# EAGLE design PCB-MicroSmartE (EAGLE 7.5.0)
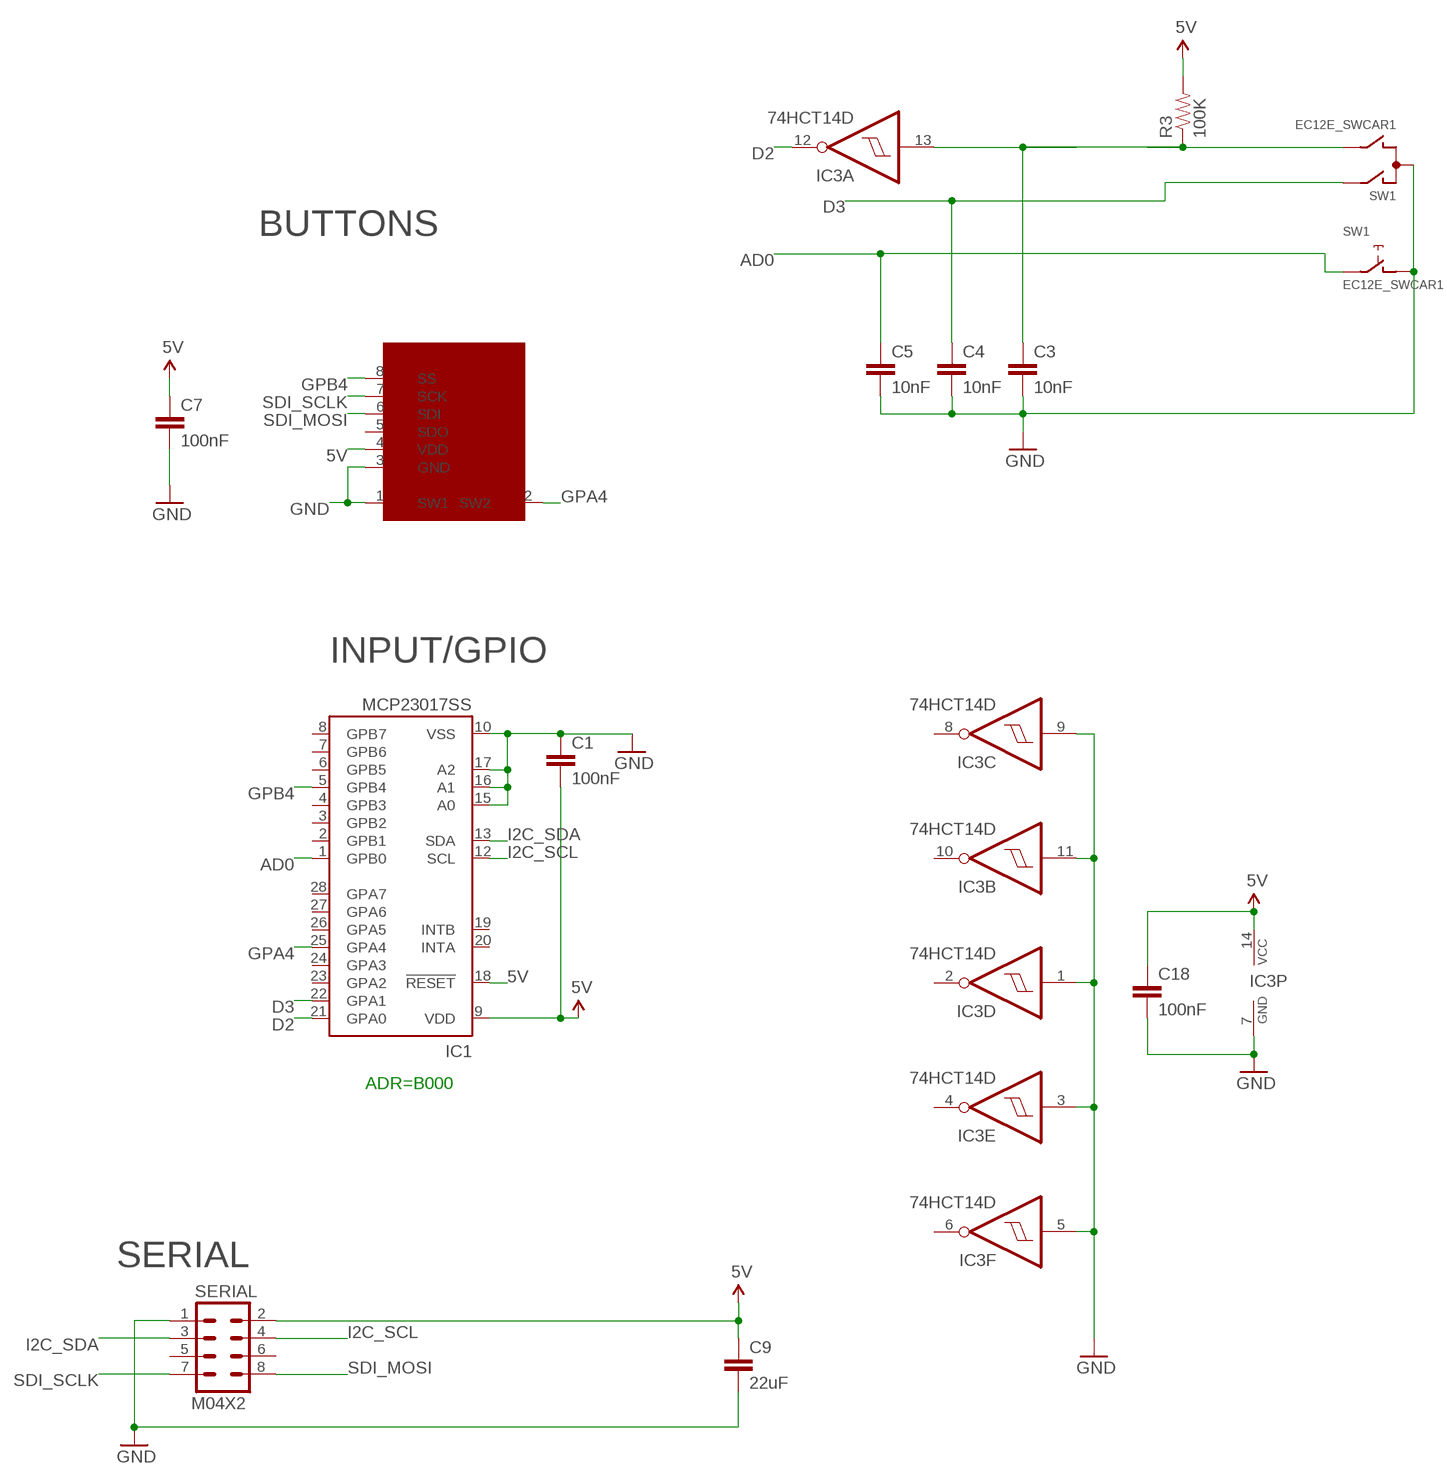
[diagram p0: schematic, sheet 1]

## Parts
C1  100nF  CAP0603-CAP  [0603-CAP]
C3  10nF  CAP0603-CAP  [0603-CAP]
C4  10nF  CAP0603-CAP  [0603-CAP]
C5  10nF  CAP0603-CAP  [0603-CAP]
C7  100nF  CAP0603-CAP  [0603-CAP]
C9  22uF  CAP0805  [0805]
C18  100nF  CAP0603-CAP  [0603-CAP]
IC1  MCP23017SS  [SSOP28]
IC3  74HCT14D  [SO14]
R3  100K  RESISTOR0603-RES  [0603-RES]
SERIAL  M04X2  [2X4]
SSW1  SMART_SWITCHSMART_SWITCH_8PIN  [SMART_SWITCH]
SW1  EC12E_SWCAR1  [ALPS_EC12E_SW-CAR1]

## Nets
5V [Power]: C1.2 C7.1 C9.1 C18.1 IC1.9(VDD) IC1.18(!RESET) IC3.14(P:VCC) R3.2 SERIAL.2 SSW1.4(VDD)
AD0: C5.1 IC1.1(GPB0) SW1.E
D2: IC1.21(GPA0) IC3.12(A:O)
D3: C4.1 IC1.22(GPA1) SW1.A
GND [Power]: C1.1 C3.2 C4.2 C5.2 C7.2 C9.2 C18.2 IC1.10(VSS) IC1.15(A0) IC1.16(A1) IC1.17(A2) IC3.1(D:I) IC3.3(E:I) IC3.5(F:I) IC3.7(P:GND) IC3.9(C:I) IC3.11(B:I) SERIAL.1 SSW1.1(SW1) SSW1.3(GND) SW1.C SW1.D
GPA4: IC1.25(GPA4) SSW1.2(SW2)
GPB4: IC1.5(GPB4) SSW1.8(SS)
I2C_SCL: IC1.12(SCL) SERIAL.4
I2C_SDA: IC1.13(SDA) SERIAL.3
N$1: C3.1 IC3.13(A:I) R3.1 SW1.B
SDI_MOSI: SERIAL.8 SSW1.6(SDI)
SDI_SCLK: SERIAL.7 SSW1.7(SCK)
Unconnected: IC1.2(GPB1) IC1.3(GPB2) IC1.4(GPB3) IC1.6(GPB5) IC1.7(GPB6) IC1.8(GPB7) IC1.19(INTB) IC1.20(INTA) IC1.23(GPA2) IC1.24(GPA3) IC1.26(GPA5) IC1.27(GPA6) IC1.28(GPA7) IC3.2(D:O) IC3.4(E:O) IC3.6(F:O) IC3.8(C:O) IC3.10(B:O) SERIAL.5 SERIAL.6 SSW1.5(SDO) SW1.GND1(G) SW1.GND2(G)

## Notes on the sheet
- BUTTONS
- INPUT/GPIO
- ADR=B000
- SERIAL

## Library data of the parts
C1 C3-C5 C7 C9 C18 = SparkFun:CAP: Capacitor Standard 0603 ceramic capacitor, and 0.1" leaded capacitor.
IC1 = microchip:MCP23017: http://ww1.microchip.com/downloads/en/DeviceDoc/21952a.pdf Source: http://ww1.microchip.com/downloads/en/DeviceDoc/21952a.pdf; MF: MICROCHIP; MPN: MCP23017-E/SS; OC_FARNELL: 1467674; OC_NEWARK: 31K2960
IC3 = 74xx-eu:74*14: Hex schmitt trigger INVERTER
R3 = SparkFun:RESISTOR: Resistor Basic schematic elements and footprints for 0603, 1206, and PTH resistors.
SERIAL = SparkFun:M04X2
SSW1 = SKAARHOJ:SMART_SWITCH: SMARTSWITCH IS15DSBFP4RGB www.nkksmartswitch.com
SW1 = SKAARHOJ:EC12E_SW: ALPS rotary Encoder EC12E series with switch

## Net classes
0 default: width 0.203 mm, drill 0.406 mm, clearance 0.203 mm
1 Power: width 0.406 mm, drill 0.61 mm, clearance 0.203 mm

## Board
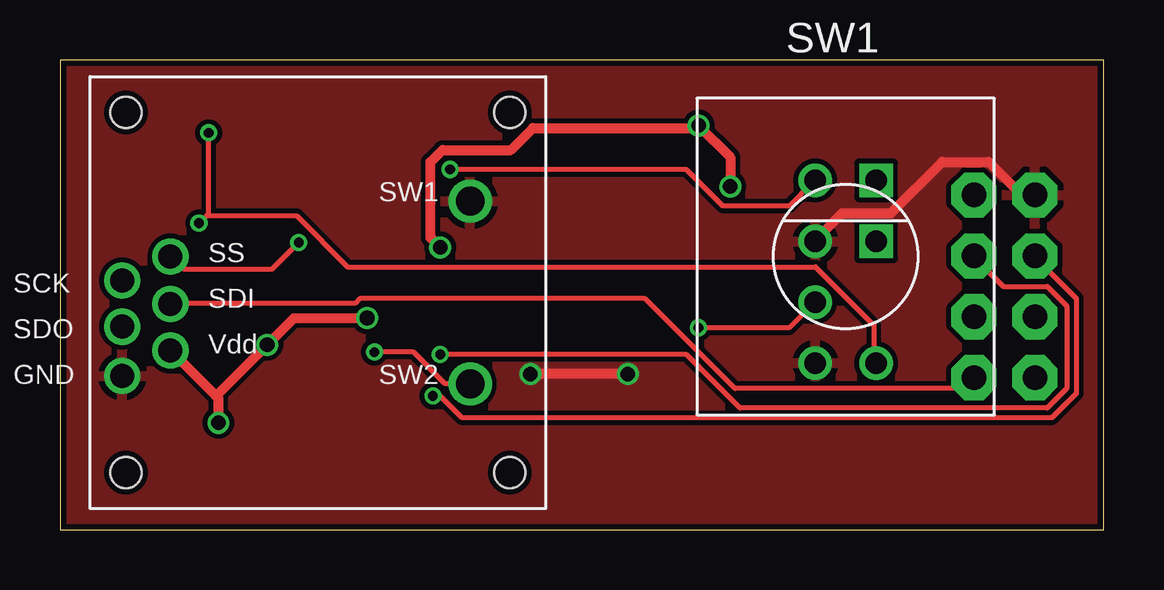
[diagram p1: board, top side]
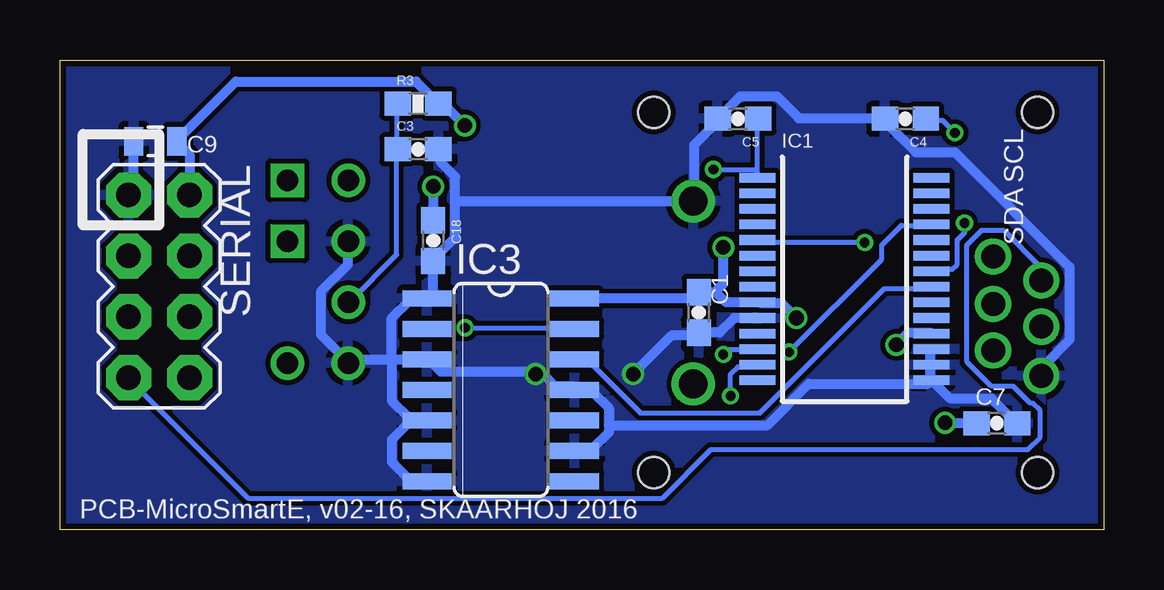
[diagram p2: board, bottom side, seen from below]

Size 43.5 x 19.6 mm. Coordinates in mm from the lower left corner, seen from the top.
Outline: 0,0 43.5,0 43.5,19.6 0,19.6 0,0
Copper layers (1*16): Top 0.035mm / dielectric 1.5mm / Bottom 0.035mm
Design rules "Fusion_eagle_rule_v1.1": minimum track width 6mil, minimum drill 12mil, track to track 6mil, track to pad 6mil, pad to pad 6mil, via to via 6mil, smd to smd 0mil, copper to edge 10mil, drill to drill 10mil, minimum pad ring 10mil, minimum via ring 6mil, stop-mask expansion 2mil, vias tented up to drill 100mil, thermal gap 10mil

### Footprints (pad centres in the part's own frame; a part is rotated, then mirrored left to right if it is on the bottom)
0603-CAP = smd 1.1 x 1: 1 -0.85,0; 2 0.85,0
0805 = smd 0.8 x 1.2: 1 -0.9,0; 2 0.9,0
SSOP28 = smd 0.4 x 1.5: 1 -4.225,-3.625; 2 -3.575,-3.625; 3 -2.925,-3.625; 4 -2.275,-3.625; 5 -1.625,-3.625; 6 -0.975,-3.625; 7 -0.325,-3.625; 8 0.325,-3.625; 9 0.975,-3.625; 10 1.625,-3.625; 11 2.275,-3.625; 12 2.925,-3.625; 13 3.575,-3.625; 14 4.225,-3.625; 15 4.225,3.625; 16 3.575,3.625; 17 2.925,3.625; 18 2.275,3.625; 19 1.625,3.625; 20 0.975,3.625; 21 0.325,3.625; 22 -0.325,3.625; 23 -0.975,3.625; 24 -1.625,3.625; 25 -2.275,3.625; 26 -2.925,3.625; 27 -3.575,3.625; 28 -4.225,3.625
SO14 = smd 0.66 x 2.032: 1 -3.81,-3.073; 2 -2.54,-3.073; 3 -1.27,-3.073; 4 0,-3.073; 5 1.27,-3.073; 6 2.54,-3.073; 7 3.81,-3.073; 8 3.81,3.073; 9 2.54,3.073; 10 1.27,3.073; 11 0,3.073; 12 -1.27,3.073; 13 -2.54,3.073; 14 -3.81,3.073
0603-RES = smd 1.1 x 1: 1 -0.85,0; 2 0.85,0
2X4 = drill 1.016 pad 1.88 octagon: 1 -3.81,-1.27; 2 -3.81,1.27; 3 -1.27,-1.27; 4 -1.27,1.27; 5 1.27,-1.27; 6 1.27,1.27; 7 3.81,-1.27; 8 3.81,1.27
SMART_SWITCH = drill 1.2: 1 6.35,3.81; 2 6.35,-3.81 | drill 1: 3 -8.153,-3.48; 4 -6.147,-2.413; 5 -8.153,-1.422; 6 -6.147,-0.483; 7 -8.153,0.508; 8 -6.147,1.499 | hole 1.3: -8.001,7.506; 8.001,7.506; 8.001,-7.506; -8.001,-7.506
ALPS_EC12E_SW-CAR1 = drill 0.9: A 1.27,-4.445; B -1.27,-1.905; C -1.27,-4.445; D -1.27,0.635; E -1.27,3.175 | drill 0.9 square: GND1 1.27,3.175; GND2 1.27,0.635

### Placement (x,y rotation side)
C1  16.87,9.07 90 bottom
C3  28.57,15.88 0 bottom
C4  8.26,17.14 180 bottom
C5  15.24,17.14 180 bottom
C7  4.45,4.45 0 bottom
C9  39.52,16.21 180 bottom
C18  27.94,12.06 270 bottom
IC1  10.79,10.46 270 bottom
IC3  25.12,5.84 270 bottom
R3  28.57,17.78 0 bottom
SERIAL  39.37,10.16 270 bottom
SSW1  10.75,9.9 0 top
SW1  32.75,11.4 0 top

### Tracks (layer width: path | path; a pad name or v marks a point on that pad's centre or on a via)
5V  (via drill 0.61)
  Top 0.406: v27.94,14.33 27.94,15.54 v26.62,16.87 26.52,16.76 19.71,16.76 18.8,15.85 15.95,15.85 15.44,15.34 15.44,12.19 v15.85,11.79 | v6.6,4.47 6.6,5.49 6.5,5.59 | 6.5,5.59 4.67,7.42 SSW1.4 | 6.5,5.59 v8.64,7.72 9.75,8.84 v12.8,8.84
  Bottom 0.406: 16.15,9.91 15.74,9.49 IC1.9 14.22,9.45 13.41,9.45 v12.8,8.84 | 16.15,9.91 16.85,9.91 C1.2 16.97,9.75 17.07,9.65 IC3.14 | v27.94,14.33 C18.1 | v26.62,16.87 27.53,17.78 R3.2 27.74,17.78 28.65,18.69 36.17,18.69 38.61,16.26 C9.1 38.51,16.05 38.1,15.65 SERIAL.2 | v6.6,4.47 5.38,4.47 C7.1 | v8.64,7.72 8.13,8.23 7.21,8.23 IC1.18 | v15.85,11.79 15.85,10.26 16.05,10.06 16.15,9.91
AD0  (via drill 0.41)
  Top 0.203: v16.26,15.04 26.11,15.04 27.64,13.51 30.38,13.51 31.39,14.53 SW1.E
  Bottom 0.203: 14.43,15.04 14.43,14.73 IC1.1 | 14.43,15.04 14.43,17.07 C5.1 | v16.26,15.04 14.43,15.04
D2
  Bottom 0.203: IC3.12 21.54,7.11 19.3,4.88 14.33,4.88 9.14,10.06 7.21,10.06 IC1.21
D3  (via drill 0.41)
  Top 0.203: v6.2,16.56 6.2,13.21 6.15,13.16 | v5.79,12.8 6.15,13.16 | SW1.A 33.93,7.01 33.93,8.53 31.5,10.97 11.99,10.97 9.86,13.11 6.2,13.11 6.15,13.16
  Bottom 0.203: v6.2,16.56 6.71,17.07 7.32,17.07 C4.1 | v5.79,12.8 5.79,12.39 6.1,12.09 6.1,11.07 6.3,10.87 7.11,10.87 IC1.22
GND  (via drill 0.61)
  Top 0.406: v23.67,6.5 v19.61,6.5 | SERIAL.1 40.64,14.02 40.03,14.02 38.71,15.34 36.78,15.34 34.65,13.21 32.61,13.21 31.5,12.09 SW1.D
  Bottom 0.406: IC1.10 15.39,8.84 16,8.23 16.85,8.23 C1.1 16.97,8.13 17.98,8.13 v19.61,6.5 | SSW1.3 2.54,6.5 2.54,6.81 1.42,7.92 1.42,10.97 6.2,15.75 7.82,15.75 9.04,16.97 C4.2 9.14,17.17 12.7,17.17 13.61,18.09 15.14,18.09 16.05,17.17 C5.2 16.15,16.97 17.07,16.05 17.07,13.72 SSW1.1 17.27,13.72 27.03,13.72 | C7.2 3.66,4.47 4.67,5.49 6.4,5.49 7.11,6.2 IC1.15 | IC1.15 7.21,6.4 7.21,6.81 IC1.16 7.21,7.01 7.21,7.52 IC1.17 | 20.62,4.37 20.62,5.08 21.34,5.79 22.05,5.79 IC3.11 22.15,5.99 22.86,5.99 23.37,6.5 v23.67,6.5 23.77,6.6 27.64,6.6 28.04,7.01 IC3.3 29.67,7.11 | 20.62,4.37 20.62,4.06 21.34,3.35 22.05,3.35 IC3.9 | 20.62,4.37 14.02,4.37 12.29,6.1 7.32,6.1 IC1.15 | 27.03,13.72 27.03,12.19 27.84,11.38 C18.2 27.94,9.86 28.14,9.65 IC3.1 28.35,9.55 28.96,9.55 29.67,8.84 29.67,7.11 | 27.03,13.72 27.03,14.73 27.64,15.34 27.64,15.85 C3.2 | C9.2 40.44,16.15 40.44,14.22 40.64,14.02 SERIAL.1 | IC3.7 28.85,2.03 29.67,2.85 29.67,3.76 28.85,4.57 IC3.5 28.96,4.67 29.67,5.38 29.67,7.11 | 29.67,7.11 31.29,7.11 31.39,7.01 SW1.C 31.6,7.11 32.61,8.13 32.61,9.96 31.5,11.07 31.5,11.99 SW1.D
  pour Top: 0,0 43.81,0 43.81,19.68 0,19.68
  pour Bottom: 0,0 43.81,0 43.81,19.68 0,19.68
GPA4  (via drill 0.41)
  Top 0.203: v13.11,7.42 14.73,7.42 16.05,6.1 17.07,6.1 SSW1.2
  Bottom 0.203: v13.11,7.42 9.25,11.28 9.25,11.89 8.43,12.7 7.21,12.7 IC1.25
GPB4  (via drill 0.41)
  Top 0.203: v9.96,11.99 8.84,10.87 5.18,10.87 4.67,11.38 SSW1.8
  Bottom 0.203: v9.96,11.99 14.33,11.99 IC1.5
I2C_SCL  (via drill 0.41)
  Top 0.203: v15.85,7.32 26.11,7.32 28.35,5.08 41.15,5.08 41.96,5.89 41.96,9.35 41.15,10.16 39.32,10.16 38.1,11.38 SERIAL.4
  Bottom 0.203: v15.85,7.32 15.65,7.52 14.43,7.52 IC1.12
I2C_SDA  (via drill 0.41)
  Top 0.203: v15.54,5.59 15.85,5.59 16.76,4.67 41.35,4.67 42.37,5.69 42.37,9.65 40.64,11.38 SERIAL.3
  Bottom 0.203: v15.54,5.59 15.54,6.5 15.24,6.81 14.43,6.81 IC1.13
N$1  (via drill 0.41)
  Top 0.203: v26.62,8.43 30.38,8.43 31.39,9.45 SW1.B
  Bottom 0.203: R3.1 29.46,17.78 29.46,15.95 C3.1 29.46,15.85 29.46,11.48 31.39,9.55 SW1.B | v26.62,8.43 22.05,8.43 IC3.13
SDI_MOSI
  Top 0.203: SSW1.6 4.67,9.45 12.29,9.45 12.5,9.65 24.38,9.65 28.14,5.89 37.69,5.89 38.1,6.3 SERIAL.8
SDI_SCLK
  Bottom 0.203: SSW1.7 2.64,10.46 2.64,10.97 4.17,12.5 5.08,12.5 5.69,11.89 5.69,7.01 4.67,5.99 3.76,5.99 3.05,5.28 2.95,5.28 2.64,4.98 2.64,3.86 3.15,3.35 16.36,3.35 18.39,1.32 35.66,1.32 40.64,6.3 SERIAL.7

### Text on the board
_bsilk: SCL | SDA | PCB-MicroSmartE, v02-16, SKAARHOJ 2016